# Altium schematic sheet Weatstone bridge part II.SchDoc: Wheatstone bridge part II
size A4; Revision: 1; SheetNumber: 4; SheetTotal: 5
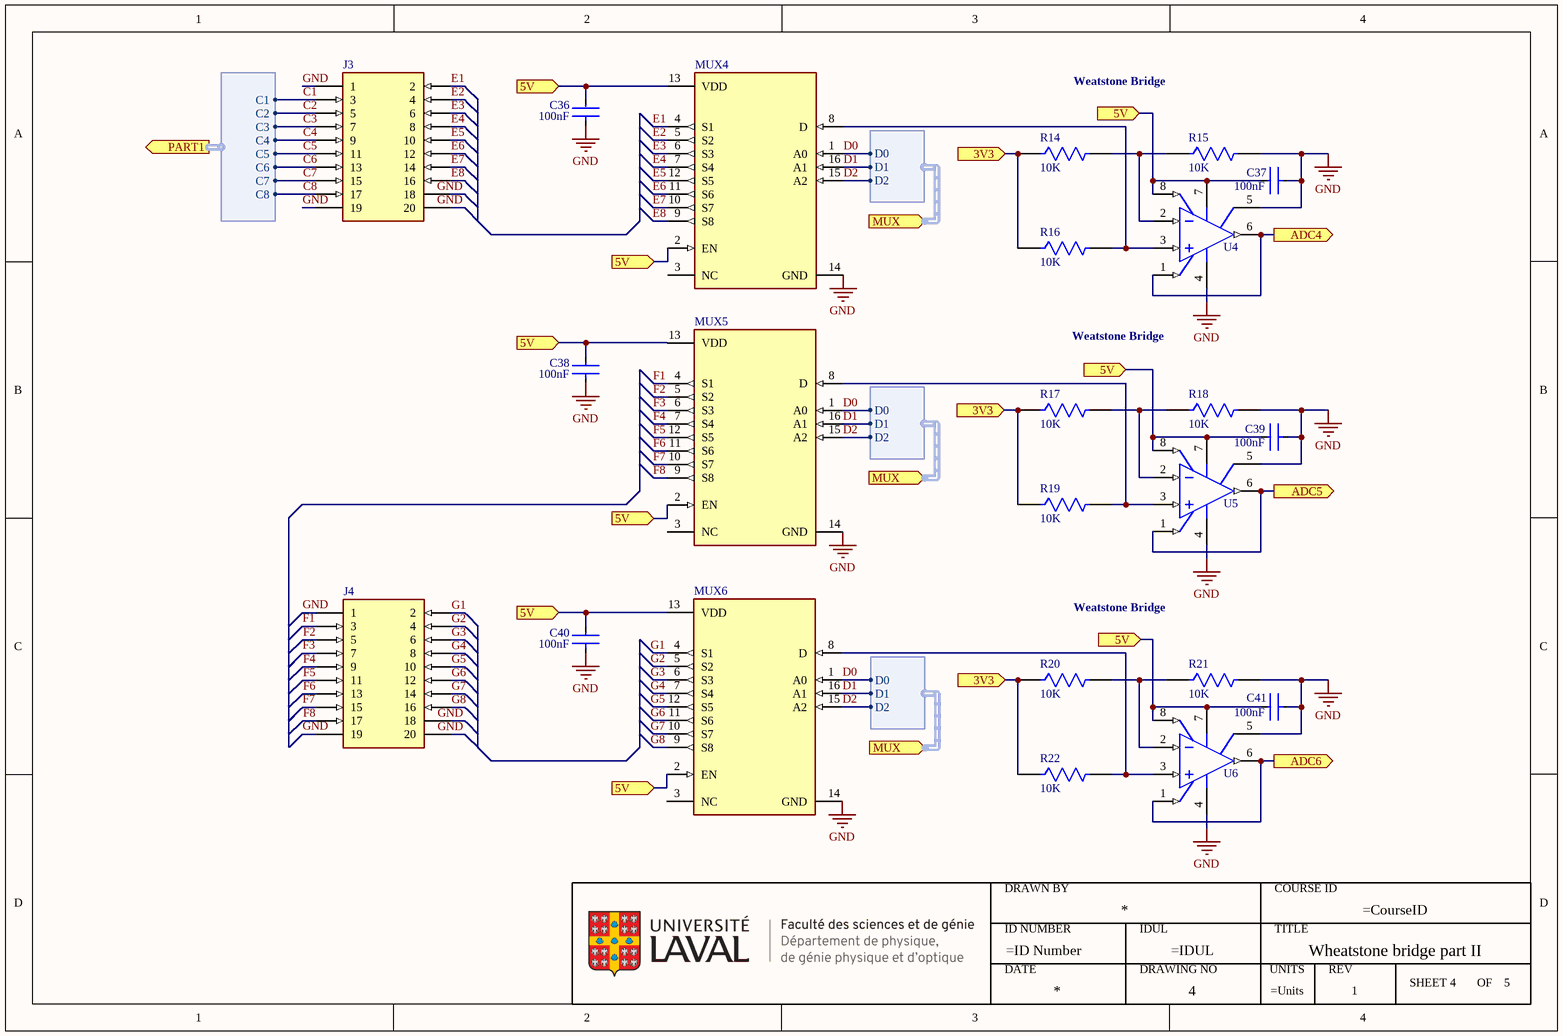
[diagram p0: Weatstone bridge part II.SchDoc]

## Parts
*4  ULaval FSG-DPGPO  (value not drawn)  (graphical)
C36  value 100nF  [FP-CC0603-DA-IPC_B]  (hidden comment: CC0603JRX7R9BB104)
C37  value 100nF  [FP-CC0603-DA-IPC_B]  (hidden comment: CC0603JRX7R9BB104)
C38  value 100nF  [FP-CC0603-DA-IPC_B]  (hidden comment: CC0603JRX7R9BB104)
C39  value 100nF  [FP-CC0603-DA-IPC_B]  (hidden comment: CC0603JRX7R9BB104)
C40  value 100nF  [FP-CC0603-DA-IPC_B]  (hidden comment: CC0603JRX7R9BB104)
C41  value 100nF  [FP-CC0603-DA-IPC_B]  (hidden comment: CC0603JRX7R9BB104)
J3  SFC-110-T1-F-D-A  [SFC-110-T1-F-D-A-Footprint-2]  (value not drawn)
J4  SFC-110-T1-F-D-A  [SFC-110-T1-F-D-A-Footprint-2]  (value not drawn)
MUX4  TMUX1208PWR  [FP-PW0016A-IPC_B]  (value not drawn)
MUX5  TMUX1208PWR  [FP-PW0016A-IPC_B]  (value not drawn)
MUX6  TMUX1208PWR  [FP-PW0016A-IPC_B]  (value not drawn)
R14  value 10K  [FP-RT0603-IPC_B]  (hidden comment: RT0603BRD0710KL)
R15  value 10K  [FP-RT0603-IPC_B]  (hidden comment: RT0603BRD0710KL)
R16  value 10K  [FP-RT0603-IPC_B]  (hidden comment: RT0603BRD0710KL)
R17  value 10K  [FP-RT0603-IPC_B]  (hidden comment: RT0603BRD0710KL)
R18  value 10K  [FP-RT0603-IPC_B]  (hidden comment: RT0603BRD0710KL)
R19  value 10K  [FP-RT0603-IPC_B]  (hidden comment: RT0603BRD0710KL)
R20  value 10K  [FP-RT0603-IPC_B]  (hidden comment: RT0603BRD0710KL)
R21  value 10K  [FP-RT0603-IPC_B]  (hidden comment: RT0603BRD0710KL)
R22  value 10K  [FP-RT0603-IPC_B]  (hidden comment: RT0603BRD0710KL)
U4  MCP6N11-100E/SN  [MCP6N11-100E/SN]  (value not drawn)
U5  MCP6N11-100E/SN  [MCP6N11-100E/SN]  (value not drawn)
U6  MCP6N11-100E/SN  [MCP6N11-100E/SN]  (value not drawn)

## Ports
3V3 (in), 5V (in), ADC4 (out), ADC5 (out), ADC6 (out), MUX (in, harness *), PART1 (out, harness J3)

## Harnesses
*: D0, D1, D2
J3: C1, C2, C3, C4, C5, C6, C7, C8

## Nets
GND: C36.1 C37.1 C38.1 C39.1 C40.1 C41.1 J3.1 J3.18 J3.19 J3.20 J4.1 J4.18 J4.19 J4.20 MUX4.14(GND) MUX5.14(GND) MUX6.14(GND) R15.2 R18.2 R21.2 U4.4(VSS) U4.5(VREF) U5.4(VSS) U5.5(VREF) U6.4(VSS) U6.5(VREF)
3V3: R14.1 R16.1 R17.1 R19.1 R20.1 R22.1 ; port 3V3
5V: C36.2 C37.2 C38.2 C39.2 C40.2 C41.2 MUX4.2(EN) MUX4.13(VDD) MUX5.2(EN) MUX5.13(VDD) MUX6.2(EN) MUX6.13(VDD) U4.7(VDD) U4.8(EN/~{CAL}) U5.7(VDD) U5.8(EN/~{CAL}) U6.7(VDD) U6.8(EN/~{CAL}) ; port 5V
ADC4: U4.1(VFG) U4.6(VOUT) ; port ADC4
ADC5: U5.1(VFG) U5.6(VOUT) ; port ADC5
ADC6: U6.1(VFG) U6.6(VOUT) ; port ADC6
C1: J3.3 ; port PART1.C1
C2: J3.5 ; port PART1.C2
C3: J3.7 ; port PART1.C3
C4: J3.9 ; port PART1.C4
C5: J3.11 ; port PART1.C5
C6: J3.13 ; port PART1.C6
C7: J3.15 ; port PART1.C7
C8: J3.17 ; port PART1.C8
D0: MUX4.1(A0) MUX5.1(A0) MUX6.1(A0) ; port MUX.D0
D1: MUX4.16(A1) MUX5.16(A1) MUX6.16(A1) ; port MUX.D1
D2: MUX4.15(A2) MUX5.15(A2) MUX6.15(A2) ; port MUX.D2
E1: J3.2 MUX4.4(S1)
E2: J3.4 MUX4.5(S2)
E3: J3.6 MUX4.6(S3)
E4: J3.8 MUX4.7(S4)
E5: J3.10 MUX4.12(S5)
E6: J3.12 MUX4.11(S6)
E7: J3.14 MUX4.10(S7)
E8: J3.16 MUX4.9(S8)
F1: J4.3 MUX5.4(S1)
F2: J4.5 MUX5.5(S2)
F3: J4.7 MUX5.6(S3)
F4: J4.9 MUX5.7(S4)
F5: J4.11 MUX5.12(S5)
F6: J4.13 MUX5.11(S6)
F7: J4.15 MUX5.10(S7)
F8: J4.17 MUX5.9(S8)
G1: J4.2 MUX6.4(S1)
G2: J4.4 MUX6.5(S2)
G3: J4.6 MUX6.6(S3)
G4: J4.8 MUX6.7(S4)
G5: J4.10 MUX6.12(S5)
G6: J4.12 MUX6.11(S6)
G7: J4.14 MUX6.10(S7)
G8: J4.16 MUX6.9(S8)
NetMUX4_8: MUX4.8(D) R16.2 U4.3(VIP)
NetMUX5_8: MUX5.8(D) R19.2 U5.3(VIP)
NetMUX6_8: MUX6.8(D) R22.2 U6.3(VIP)
NetR14_2: R14.2 R15.1 U4.2(VIM)
NetR17_2: R17.2 R18.1 U5.2(VIM)
NetR20_2: R20.2 R21.1 U6.2(VIM)

Not connected (* = marked no-connect by the designer): MUX4 3(NC); MUX5 3(NC); MUX6 3(NC)

## Notes on the sheet
- Weatstone Bridge
- (in symbol ULaval FSG-DPGPO) DRAWN BY; COURSE ID; ID NUMBER; IDUL; TITLE; DATE; DRAWING NO; UNITS; REV; SHEET; OF

## Library data of the parts
C36-C41 = CMP-001-00097-1: 0603 0.1 uF 50 V ±5 % Tolerance X7R SMT Multilayer Ceramic Capacitor; Voltage Rating: 50V; Tolerance: 5%; Halogen Free: Halogen Free; Depth: 0.8mm; Case/Package: 0603; Dielectric: X7R; Thickness: 0.035inch; Series: CC; Termination: SMD/SMT; Voltage Rating (DC): 50V; Max Operating Temperature: 125°C; Weight: 7.1E-05oz; Construction: Flat; Resistor Type: Ceramic; Height: 0.8mm; Length: 0.063inch; RoHS Compliant: Yes; Lead Free: Lead Free; Pins: 2; Min Operating Temperature: -55°C; Case Code (Imperial): 0603; Radiation Hardening: No; Case Code (Metric): 1608; Mounting Technology: Surface Mount; Width: 0.031inch; Packaging: Tape and Reel
J3 J4 = CMP-002-00080-2: Headers & Wire Housings .050 Tiger Eye Cost-Effective Reliable Socket Strip; Pitch: 0.05inch; Voltage Rating (AC): 350V; Connector Type: Receptacle; Number of Contacts: 20; Gender: Female; Insulation Color: Black; Max Operating Temperature: 125°C; Min Operating Temperature: -55°C; Insulation Material: Polymer; RoHS Compliant: Yes; Row Spacing: 0.05inch; Number of Rows: 2; Contact Shape: Square; Contact Type: Female Socket; Mounting Technology: Through Hole; Termination: Solder; Fastening Type: Pull; Contact Finish - Mating: GOLD; Color: Black; Packaging: Rail/Tube; Contact Material: Bronze; Contact Plating: Gold; Number of Positions: 20; Series: Tiger Eye™ SFC
MUX4-MUX6 = CMP-015-00012-1: 5-V, 8: 1, 1-channel general-purpose analog multiplexer with 1.8-V input logic 16-TSSOP -40 to 125; RoHS Compliant: Yes
R14-R22 = CMP-009-00178-1: Res High precision Thin Film 0603 10K Ohm 0.1% 1/10W ±25ppm/°C Molded SMD Paper T/R; Max Power Dissipation: 100mW; Working Voltage: 75V; RoHS Compliant: Yes; Power Rating: 100mW; Lead Free: Lead Free; Depth: 0.8mm; Case Code (Imperial): 0603; Max Operating Temperature: 155°C; Voltage Rating: 75V; Package Quantity: 5000; Packaging: Tape and Reel; Case/Package: 0603; Height: 0.022inch; Construction: Rectangular; Min Operating Temperature: -55°C; Termination: SMD/SMT; Features: Moisture Resistant; Number of Terminations: 2; Case Code (Metric): 1608; Technology: THIN FILM; Military Standard: Not; Length: 0.063inch; Voltage Rating (DC): 75V; Temperature Coefficient: 25ppm/°C; Weight: 7.1E-05oz; Width: 0.8mm; Series: RT; Resistor Type: Thin Film
U4-U6 = CMP-014-00010-7: MCP6N11 Series Single Channel 500 KHz 5.5 V Instrumentation Amplifier - SOIC-8; Bandwidth: 500kHz; Min Supply Voltage: 1.8V; Number of Elements: 2; Gain Bandwidth Product: 35MHz; Input Offset Voltage (Vos): 350uV; Number of Channels: 1; Nominal Supply Current: 800uA; Common Mode Rejection Ratio: 86dB; Slew Rate: 6V/µs; Max Supply Voltage: 5.5V; Slew Rate-Nom: 9V/µs; Input Bias Current: 10pA; Mounting Technology: Surface Mount; Package Quantity: 100; Pins: 8; Width: 3.9mm; Length: 4.9mm; Case/Package: SOIC; Min Operating Temperature: -40°C; Radiation Hardening: No; RoHS Compliant: Yes; Unity Gain Bandwidth Product: 35MHz; Lead Free: Lead Free; Number of Amplifiers: 1; Max Operating Temperature: 125°C; Height: 1.25mm; Packaging: Rail/Tube; Input Offset Voltage-Max: 350uV; Reach SVHC Compliant: Yes; Supply Current: 800uA; Max Supply Current: 800uA; Power Supply Rejection Ratio (PSRR): 86dB; Number of Circuits: 1